# EAGLE schematic FM-Scheme (EAGLE 6.4)
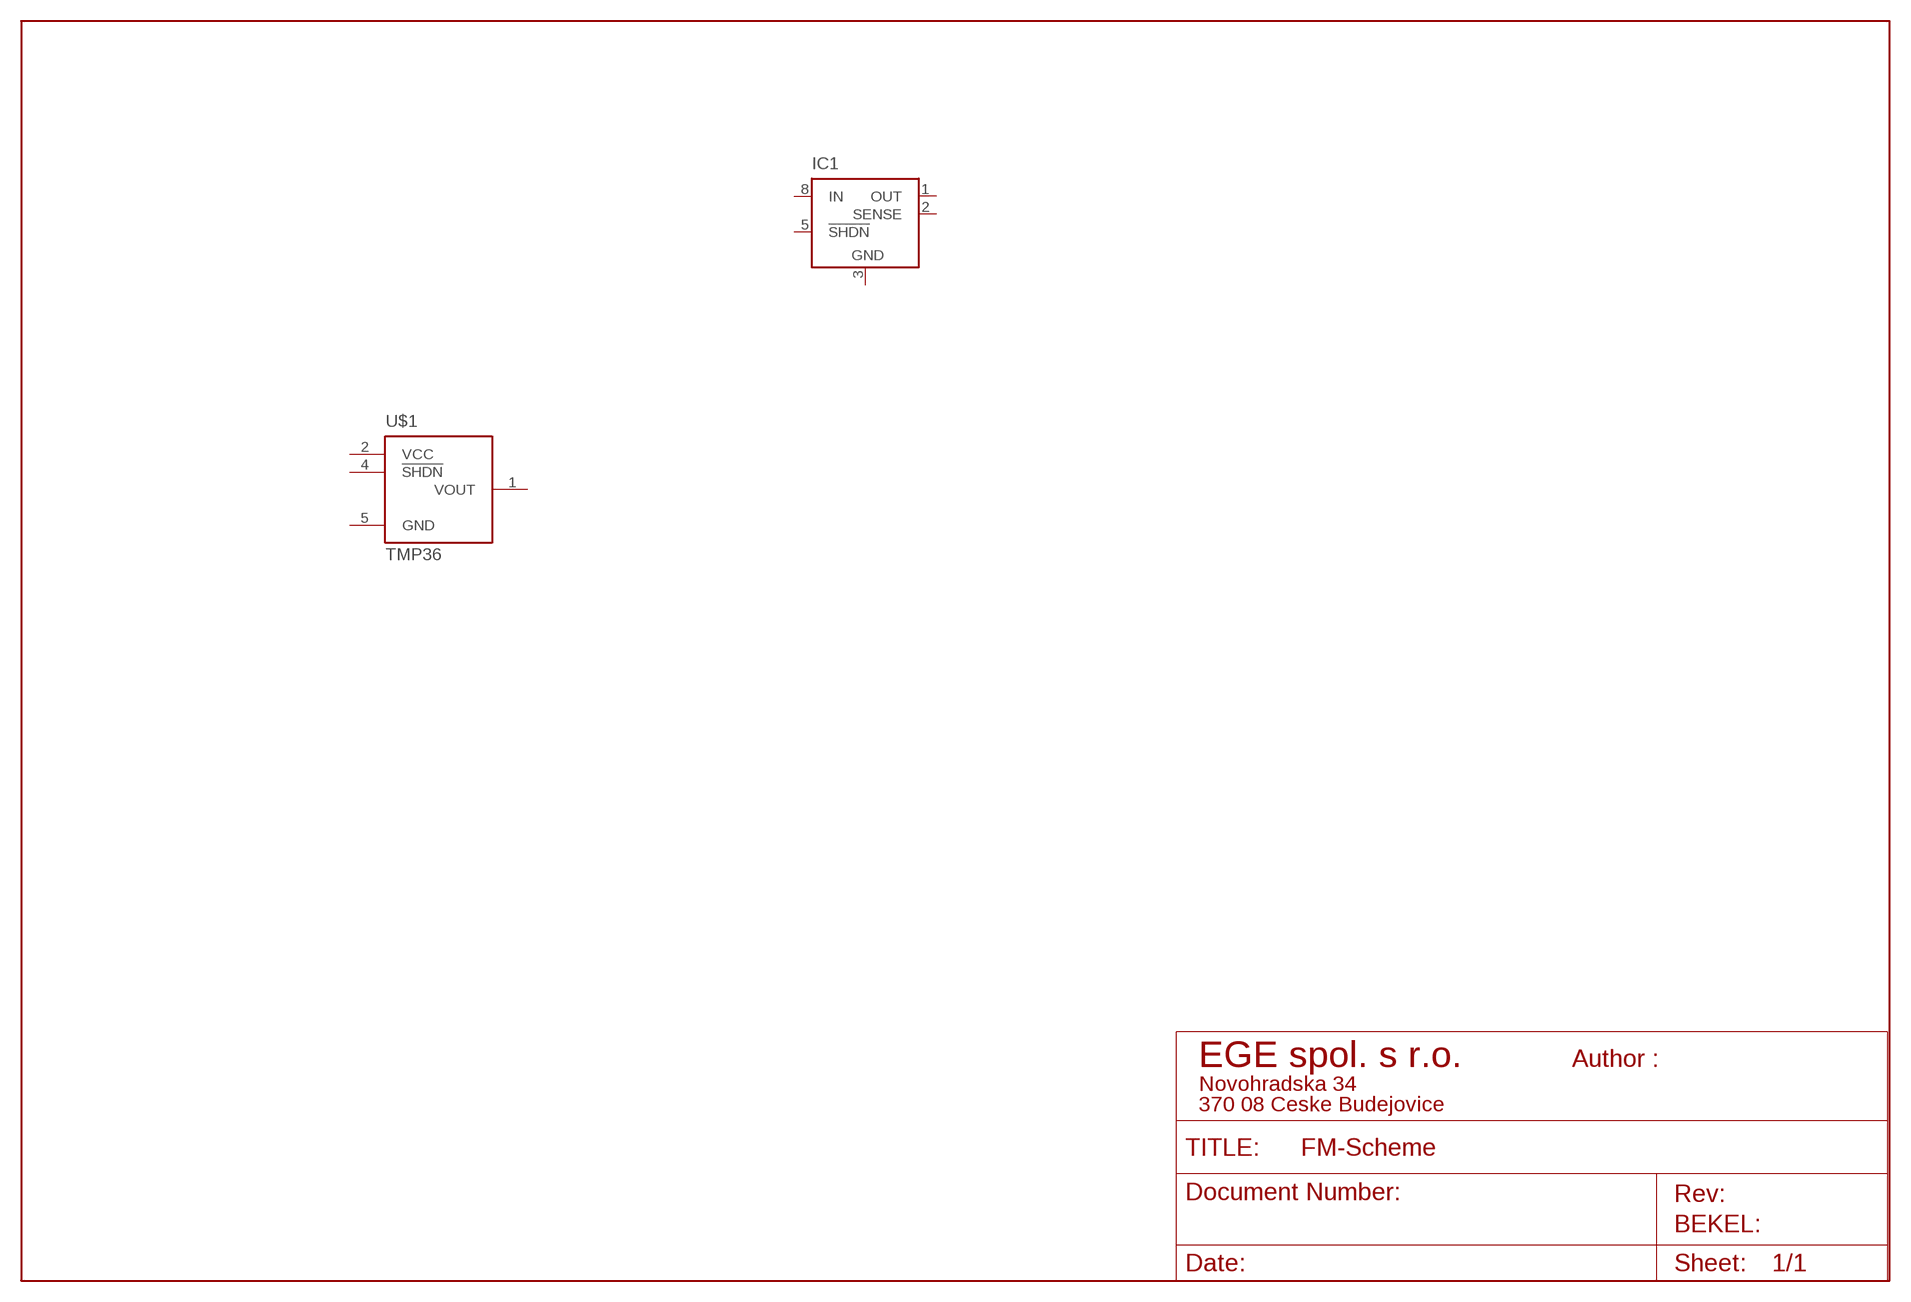
[diagram p0: schematic, sheet 1]
FRAME1 (DINA4_L_EGE): COMPANY: EGE spol. s r.o.; STREET_NR: Novohradska 34; ZIP_CITY: 370 08 Ceske Budejovice

## Parts
IC1  LT1129CS8  [SOIC8]
U$1  TMP36  [SOT23-5]
Unconnected: IC1.1(OUT) IC1.2(SENSE) IC1.4(NC) IC1.5(!SHDN) IC1.8(IN) U$1.1(VOUT) U$1.2(VCC) U$1.4(!SHDN) U$1.5(GND)

## Power pins joined to a net without a drawn wire
GND: IC1.3(GND) IC1.6(GND) IC1.7(GND)

## Library data of the parts
IC1 = linear-technology:LT1129CS8: VOLTAGE REGULATOR with shutdown; MPN: LT1129CS8-5#PBF; OC_FARNELL: 1273576; OC_NEWARK: 57M2078
U$1 = ege:TMP36: Temperature sensor with analog output Features: Low voltage operation (2.7 V to 5.5 V) Calibrated directly in °C 10 mV/°C scale factor (20 mV/°C on TMP37) ±2°C accuracy over temperature (typ) ±0.5°C linearity (typ) Stable with large capacitive loads Specified −40°C to +125°C, operation to +150°C Less than 50 μA quiescent current Shutdown current 0.5 μA max Low self-heating Qualified for automotive applications For more info see: http://www.analog.com/en/products/analog-to-digital-converters/integrated-special-purpose-converters/integrated-temperature-sensors/tmp36.html